# EAGLE design ArduinoShield (EAGLE 9.4.1)
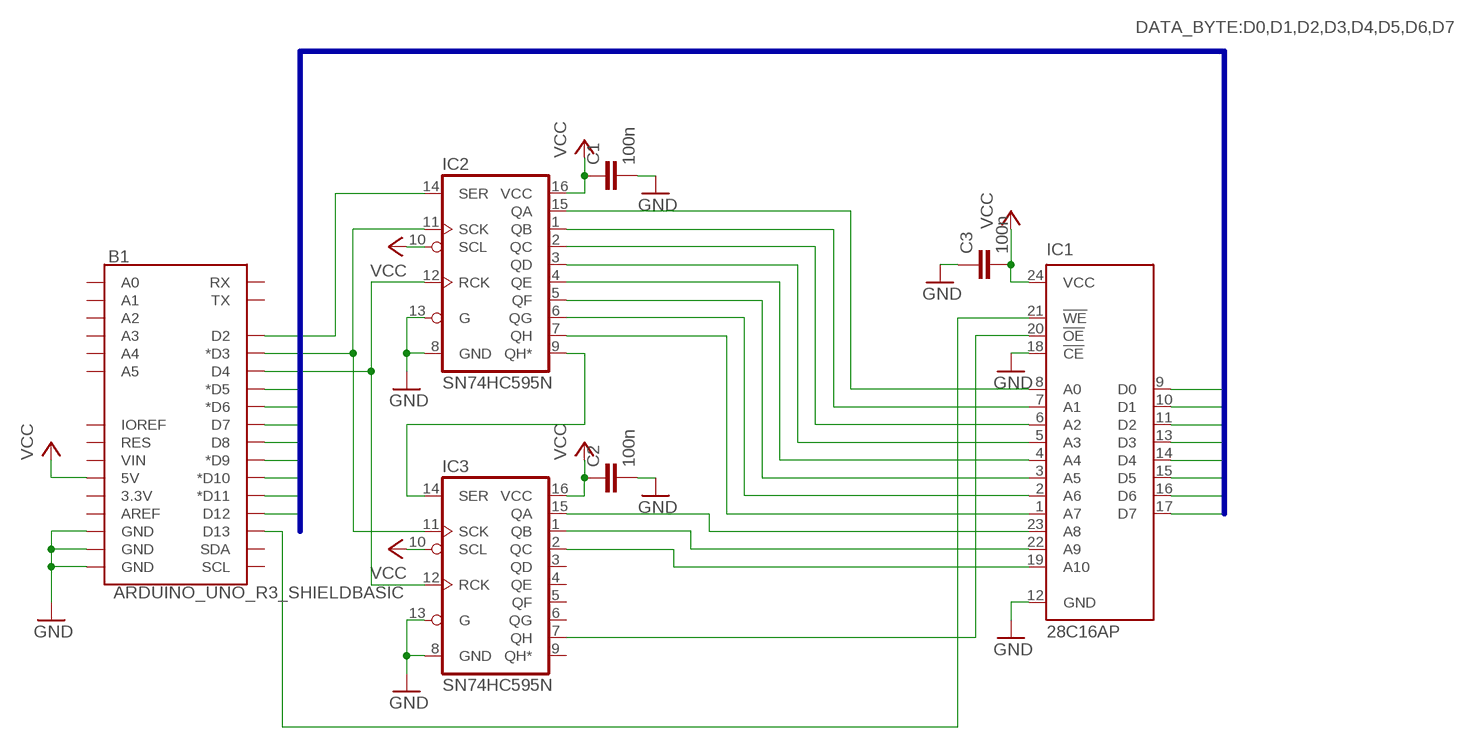
[diagram p0: schematic, sheet 1]

## Parts
B1  ARDUINO_UNO_R3_SHIELDBASIC  [UNO_R3_SHIELD]
C1  100n  C-EU050-024X044  [C050-024X044]
C2  100n  C-EU050-024X044  [C050-024X044]
C3  100n  C-EU050-024X044  [C050-024X044]
IC1  28C16AP  [DIL24-6]
IC2  SN74HC595N  74HC595N  [DIP16]
IC3  SN74HC595N  74HC595N  [DIP16]

## Nets
D0: B1.D5(*D5) IC1.9(D0)
D1: B1.D6(*D6) IC1.10(D1)
D2: B1.D7 IC1.11(D2)
D3: B1.D8 IC1.13(D3)
D4: B1.D9(*D9) IC1.14(D4)
D5: B1.D10(*D10) IC1.15(D5)
D6: B1.D11(*D11) IC1.16(D6)
D7: B1.D12 IC1.17(D7)
GND: B1.GND@0(GND) B1.GND@1(GND) B1.GND@2(GND) C1.2 C2.2 C3.1 IC1.12(GND) IC1.18(!CE) IC2.8(GND) IC2.13(G) IC3.8(GND) IC3.13(G)
N$1: B1.D2 IC2.14(SER)
N$2: IC2.9(QH*) IC3.14(SER)
N$3: B1.D3(*D3) IC2.11(SCK) IC3.11(SCK)
N$4: B1.D13 IC1.21(!WE)
N$5: B1.D4 IC2.12(RCK) IC3.12(RCK)
N$6: IC1.8(A0) IC2.15(QA)
N$7: IC1.7(A1) IC2.1(QB)
N$8: IC1.6(A2) IC2.2(QC)
N$9: IC1.5(A3) IC2.3(QD)
N$10: IC1.4(A4) IC2.4(QE)
N$11: IC1.3(A5) IC2.5(QF)
N$12: IC1.2(A6) IC2.6(QG)
N$13: IC1.1(A7) IC2.7(QH)
N$14: IC1.23(A8) IC3.15(QA)
N$15: IC1.22(A9) IC3.1(QB)
N$16: IC1.19(A10) IC3.2(QC)
N$17: IC1.20(!OE) IC3.7(QH)
VCC: B1.5V C1.1 C2.1 C3.2 IC1.24(VCC) IC2.10(SCL) IC2.16(VCC) IC3.10(SCL) IC3.16(VCC)
Unconnected: B1.3.3V B1.A0 B1.A1 B1.A2 B1.A3 B1.A4 B1.A5 B1.AREF B1.IOREF B1.RES B1.RX B1.SCL B1.SDA B1.TX B1.VIN IC3.3(QD) IC3.4(QE) IC3.5(QF) IC3.6(QG) IC3.9(QH*)

## Buses
DATA_BYTE:D0,D1,D2,D3,D4,D5,D6,D7

## Library data of the parts
B1 = SparkFun-Boards:ARDUINO_UNO_R3_SHIELD: Arduino R3 Shield Footprint Shield form compatible with the Arduino Uno R3. SparkFun Products: MG2639 Cellular Shield <https://www.sparkfun.com/products/13120> MIDI Shield <https://www.sparkfun.com/products/12898> R3 Stackable Headers Kit <https://www.sparkfun.com/products/11417>
C1-C3 = rcl:C-EU: CAPACITOR, European symbol; SPICEPREFIX: C
IC1 = microchip:28*16A: CMOS EPROM 16 K (2 K x 8) Source: ww1.microchip.com/downloads/en/DeviceDoc/11125J.pdf; MPN: CAT28C16ALI-12; OC_FARNELL: 1718292; OC_NEWARK: 06R0648
IC2 IC3 = SparkFun-IC-Logic:74*595: 8-Bit Shift Register (Serial to Parallel) Datasheet <http://cdn.sparkfun.com/datasheets/BreakoutBoards/MM74HC595.pdf> SparkFun Products SparkFun Shift Register Breakout - 74HC595 <https://www.sparkfun.com/products/10680> (BOB-10680); PROD_ID: IC-13123

## Board
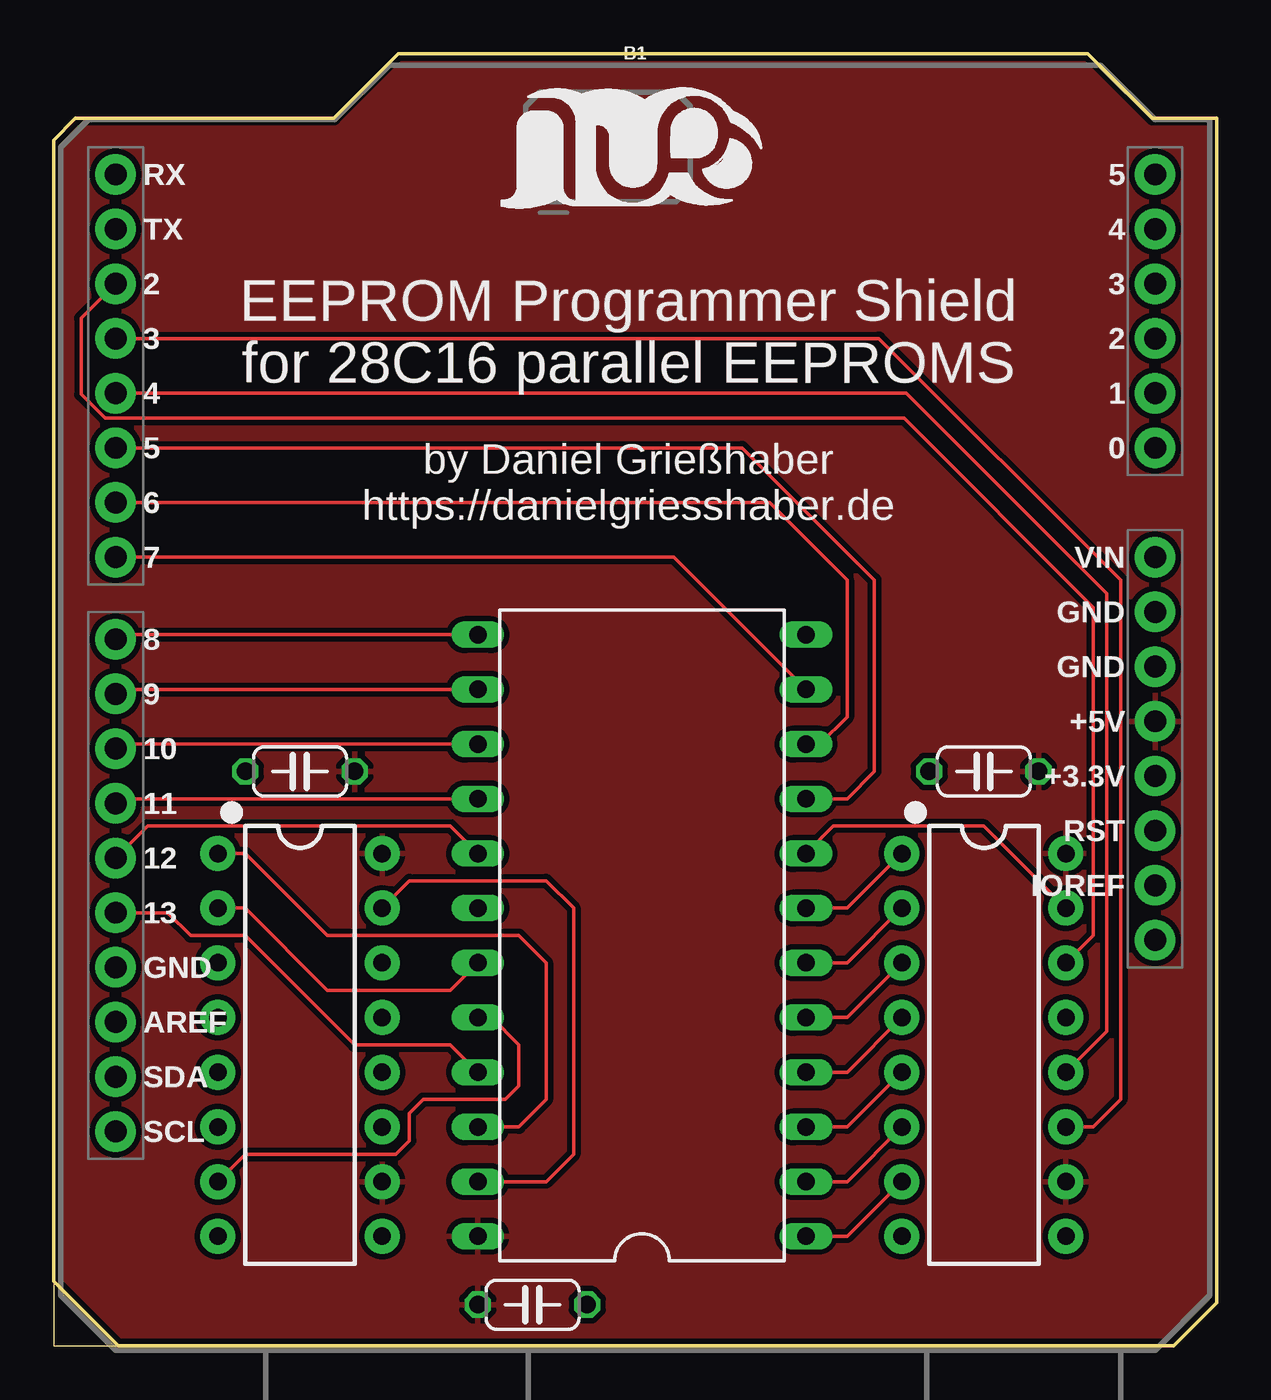
[diagram p1: board, top side]
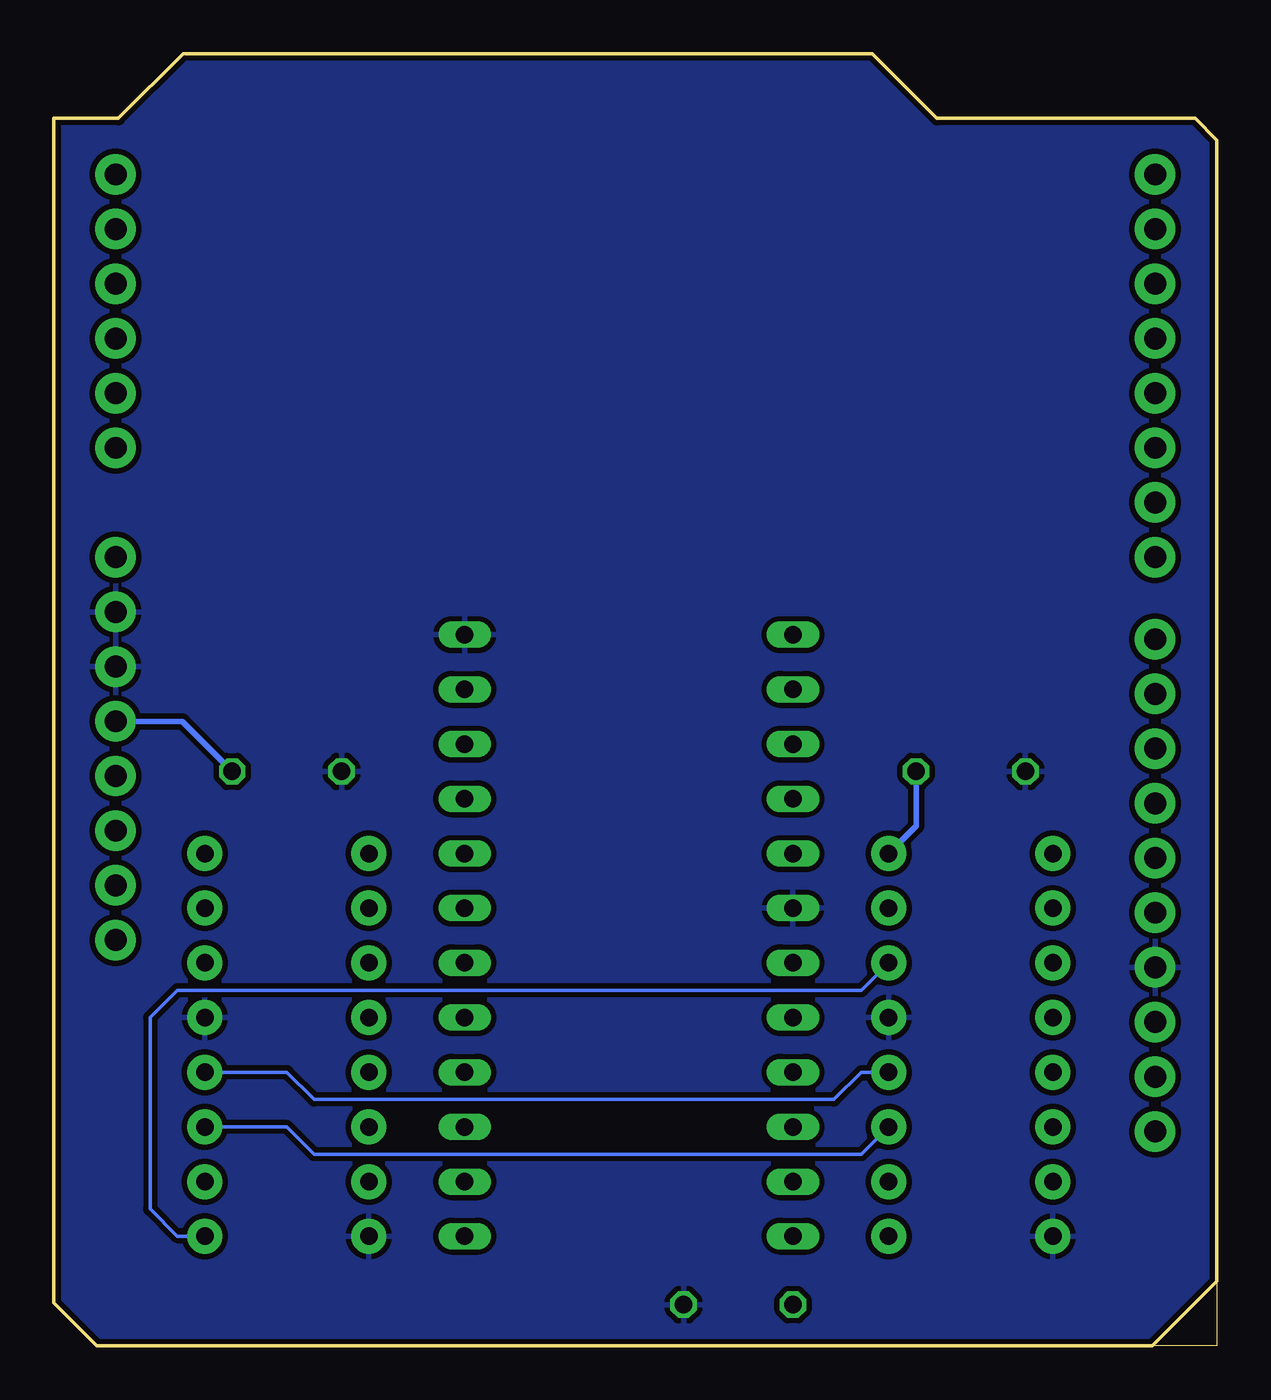
[diagram p2: board, bottom side, seen from below]

Size 54 x 60 mm. Coordinates in mm from the lower left corner, seen from the top.
Outline: 3,0 0,0 0,56
Outline: 0,56 1,57 13,57 16,60 48,60 51,57 54,57 54,2 52,0 3,0
Outline: 3,0 0,3 0,56
Copper layers (1*16): Top 0.035mm / dielectric 1.5mm / Bottom 0.035mm
Design rules "JLCPCB-Tented": minimum track width 3.5mil, minimum drill 0.2mm, track to track 3.5mil, track to pad 5mil, pad to pad 6mil, via to via 6mil, smd to smd 3.5mil, copper to edge 0.2mm, drill to drill 5mil, minimum pad ring 3mil, minimum via ring 3mil, stop-mask expansion 4mil, vias tented up to drill 0.5mil, thermal gap 10mil

### Footprints (pad centres in the part's own frame; a part is rotated, then mirrored left to right if it is on the bottom)
UNO_R3_SHIELD = drill 1.016 pad 1.88: 3.3V 24.13,-2.54; 5V 24.13,0; A0 24.13,12.7; A1 24.13,15.24; A2 24.13,17.78; A3 24.13,20.32; A4 24.13,22.86; A5 24.13,25.4; AREF -24.13,-13.97; D2 -24.13,20.32; D3 -24.13,17.78; D4 -24.13,15.24; D5 -24.13,12.7; D6 -24.13,10.16; D7 -24.13,7.62; D8 -24.13,3.81; D9 -24.13,1.27; D10 -24.13,-1.27; D11 -24.13,-3.81; D12 -24.13,-6.35; D13 -24.13,-8.89; GND@0 24.13,2.54; GND@1 24.13,5.08; GND@2 -24.13,-11.43; IOREF 24.13,-7.62; NC 24.13,-10.16; RES 24.13,-5.08; RX -24.13,25.4; SCL -24.13,-19.05; SDA -24.13,-16.51; TX -24.13,22.86; VIN 24.13,7.62
C050-024X044 = drill 0.813 octagon: 1 -2.54,0; 2 2.54,0
DIL24-6 = drill 0.813 long: 1 -13.97,-7.62; 2 -11.43,-7.62; 3 -8.89,-7.62; 4 -6.35,-7.62; 5 -3.81,-7.62; 6 -1.27,-7.62; 7 1.27,-7.62; 8 3.81,-7.62; 9 6.35,-7.62; 10 8.89,-7.62; 11 11.43,-7.62; 12 13.97,-7.62; 13 13.97,7.62; 14 11.43,7.62; 15 8.89,7.62; 16 6.35,7.62; 17 3.81,7.62; 18 1.27,7.62; 19 -1.27,7.62; 20 -3.81,7.62; 21 -6.35,7.62; 22 -8.89,7.62; 23 -11.43,7.62; 24 -13.97,7.62
DIP16 = drill 0.813 pad 1.626: 1 -8.89,-3.81; 2 -6.35,-3.81; 3 -3.81,-3.81; 4 -1.27,-3.81; 5 1.27,-3.81; 6 3.81,-3.81; 7 6.35,-3.81; 8 8.89,-3.81; 9 8.89,3.81; 10 6.35,3.81; 11 3.81,3.81; 12 1.27,3.81; 13 -1.27,3.81; 14 -3.81,3.81; 15 -6.35,3.81; 16 -8.89,3.81

### Placement (x,y rotation side)
B1  27,29 0 top
C1  11.43,26.67 180 top
C2  43.18,26.67 180 top
C3  22.23,1.91 180 top
IC1  27.3,19.05 90 top
IC2  43.18,13.97 270 top
IC3  11.43,13.97 270 top
U$1  [LOGO-SILKSCREEN]  26.67,54.61 0 top

### Tracks (layer width: path | path; a pad name or v marks a point on that pad's centre or on a via)
D0
  Top 0.152: B1.D5 31.96,41.7 38.1,35.56 38.1,26.67 36.83,25.4 IC1.9
D1
  Top 0.152: B1.D6 33.23,39.16 36.83,35.56 36.83,29.21 35.56,27.94 IC1.10
D2
  Top 0.152: B1.D7 28.79,36.62 IC1.11
D3
  Top 0.152: B1.D8 3.08,33.02 IC1.13
D4
  Top 0.152: B1.D9 3.08,30.48 IC1.14
D5
  Top 0.152: B1.D10 3.08,27.94 IC1.15
D6
  Top 0.152: B1.D11 3.08,25.4 IC1.16
D7
  Top 0.152: B1.D12 4.35,24.13 18.41,24.13 IC1.17
GND
  pour Bottom (isolate 0.254): 0,60.96 54.61,60.96 54.61,0 0,0
N$1
  Top 0.152: B1.D2 1.27,47.72 1.27,44.19 2.39,43.07 39.48,43.07 48.26,34.29 48.26,19.05 IC2.14
N$2
  Bottom 0.152: IC3.14 16.51,16.51 48.26,16.51 49.53,15.24 49.53,6.35 48.26,5.08 IC2.9
N$3
  Top 0.152: B1.D3 38.31,46.78 49.53,35.56 49.53,11.43 48.26,10.16 IC2.11
  Bottom 0.152: IC3.11 16.51,8.89 41.91,8.89 43.18,10.16 IC2.11
N$4
  Top 0.152: B1.D13 5.29,20.11 6.35,19.05 8.89,19.05 13.97,13.97 18.41,13.97 IC1.21
N$5
  Top 0.152: B1.D4 39.58,44.24 48.9,34.92 48.9,14.61 IC2.12
  Bottom 0.152: IC3.12 16.51,12.7 17.78,11.43 41.91,11.43 43.18,12.7 IC2.12
N$6
  Top 0.152: IC2.15 43.18,24.13 36.2,24.13 IC1.8
N$7
  Top 0.152: IC2.1 36.83,20.32 IC1.7
N$8
  Top 0.152: IC2.2 36.83,17.78 IC1.6
N$9
  Top 0.152: IC2.3 36.83,15.24 IC1.5
N$10
  Top 0.152: IC2.4 36.83,12.7 IC1.4
N$11
  Top 0.152: IC2.5 36.83,10.16 IC1.3
N$12
  Top 0.152: IC2.6 36.83,7.62 IC1.2
N$13
  Top 0.152: IC2.7 36.83,5.08 IC1.1
N$14
  Top 0.152: IC3.15 16.51,21.59 22.86,21.59 24.13,20.32 24.13,8.89 22.86,7.62 IC1.23
N$15
  Top 0.152: IC3.1 8.89,22.86 12.7,19.05 21.59,19.05 22.86,17.78 22.86,11.43 21.59,10.16 IC1.22
N$16
  Top 0.152: IC3.2 8.89,20.32 12.7,16.51 18.41,16.51 IC1.19
N$17
  Top 0.152: IC3.7 8.89,8.89 15.88,8.89 16.51,9.53 16.51,10.79 17.14,11.43 20.95,11.43 21.59,12.06 21.59,13.97 20.32,15.24 IC1.20
VCC
  Bottom 0.254: B1.5V 48.05,29 C2.1 | IC3.16 13.97,24.13 C1.1
  pour Top (isolate 0.254): 0,60.96 54.61,60.96 54.61,0 0,0

### Text on the board
tPlace: EEPROM Programmer Shield / for 28C16 parallel EEPROMS | by Daniel Grießhaber / https://danielgriesshaber.de